# Altium schematic sheet mboard.SchDoc
size A3
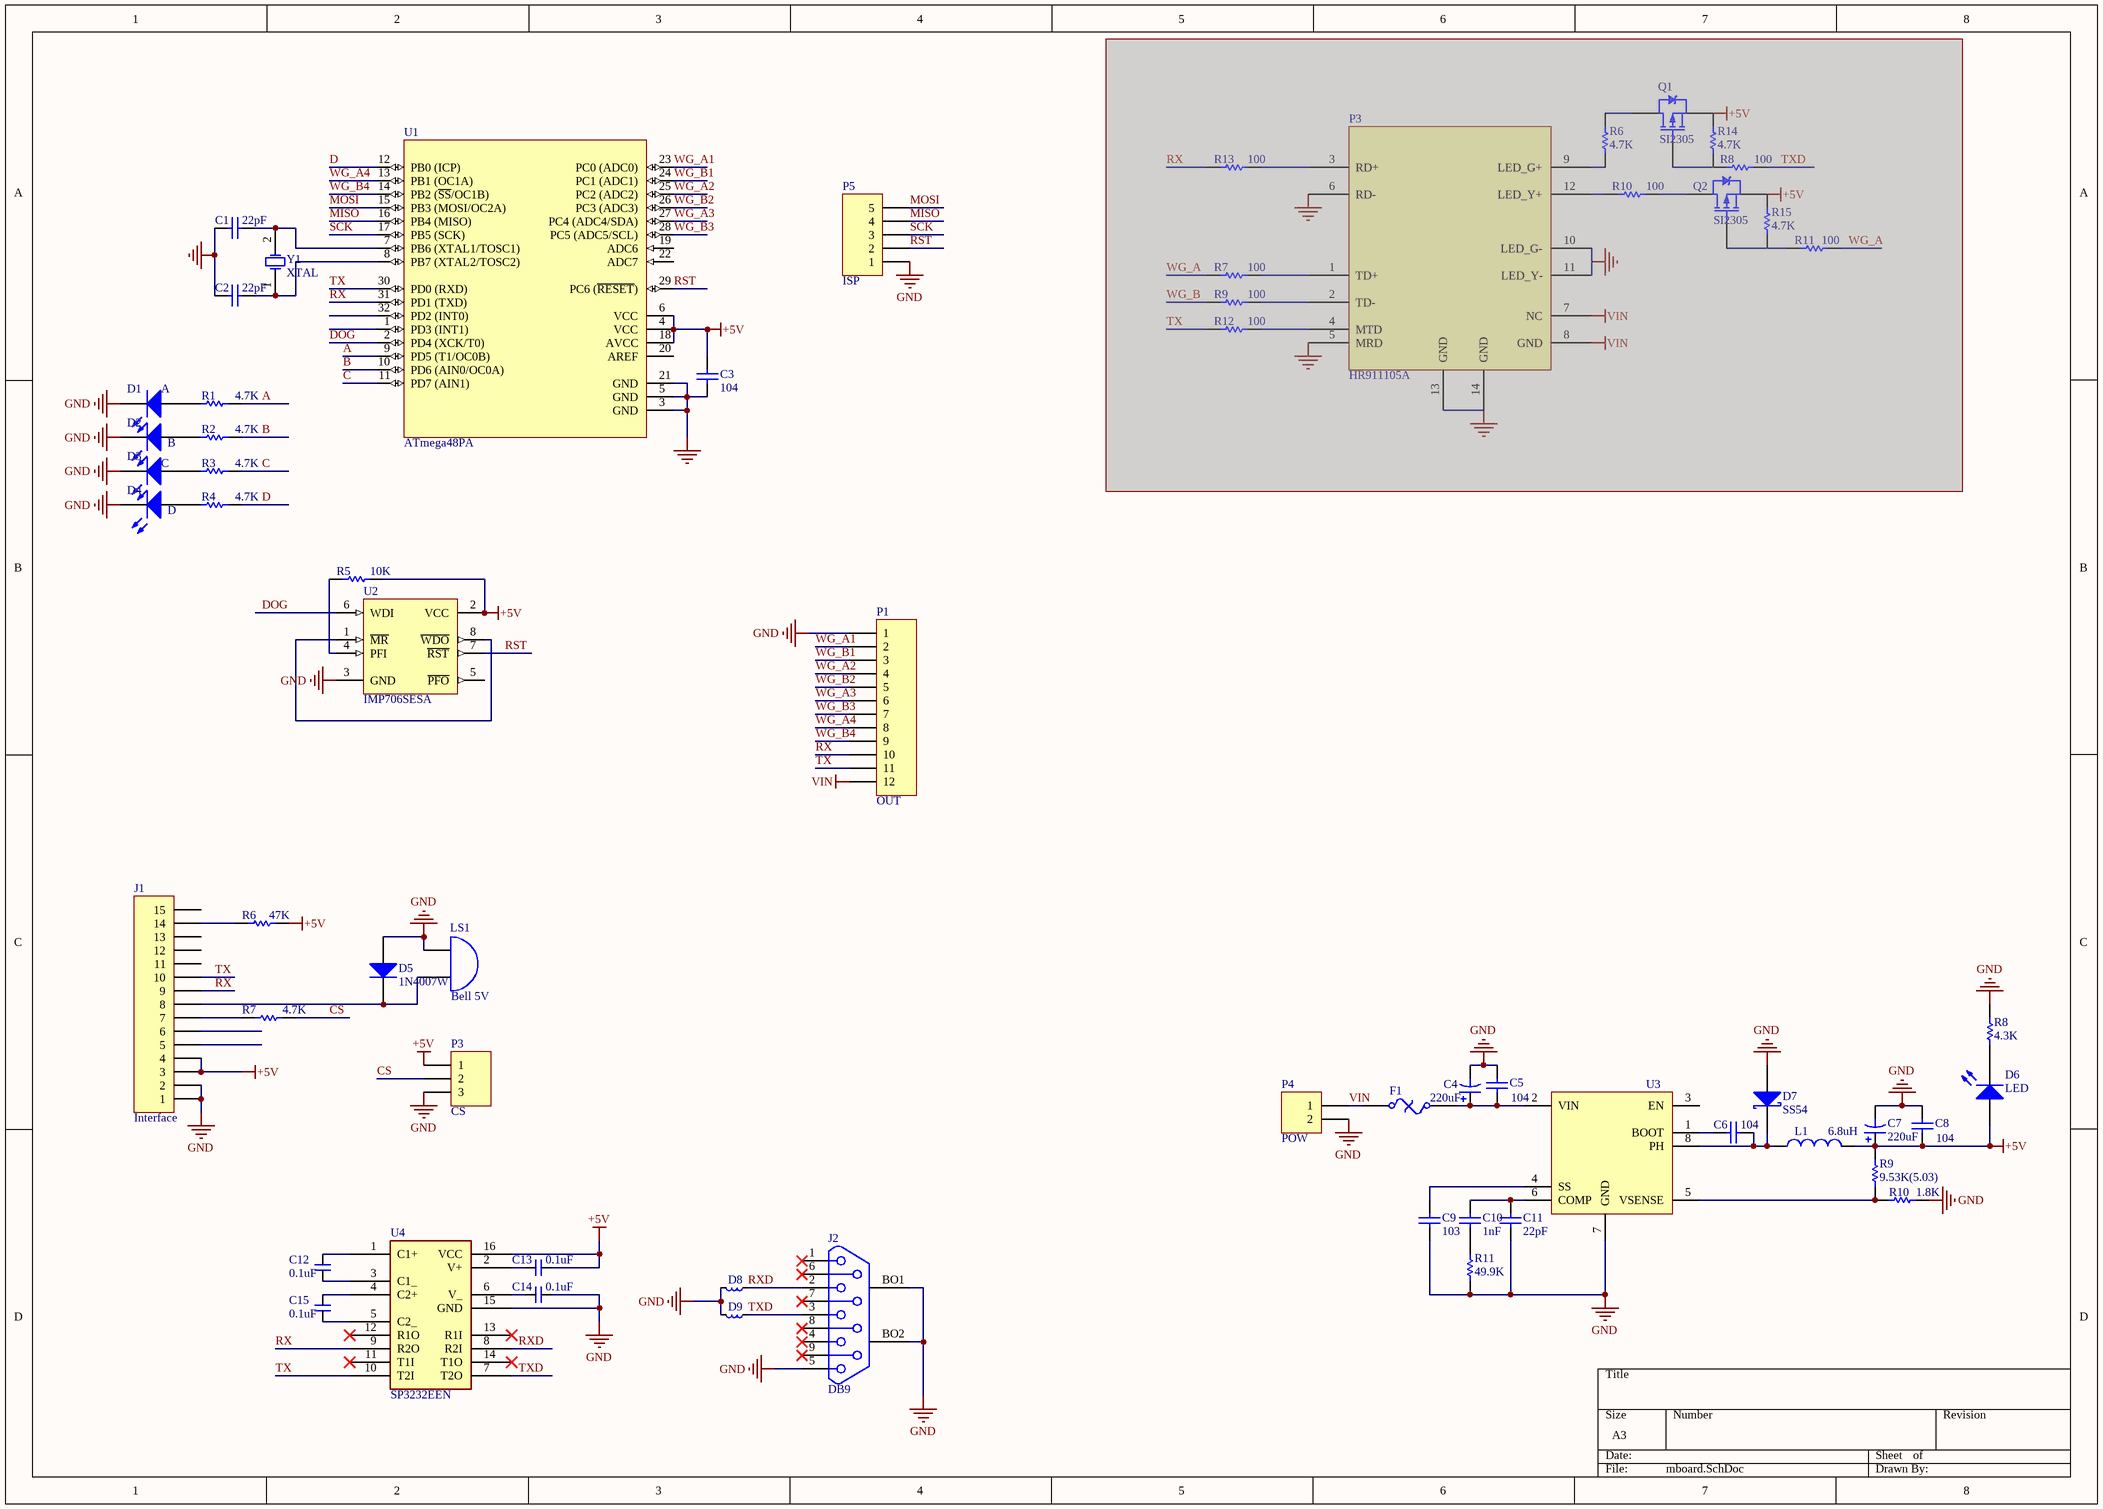
[diagram p0: mboard.SchDoc]

## Parts
(Parts that share a designator on the sheet are numbered #1, #2 ... from top to bottom, then left to right.)
C1  value 22pF  [0603C]  (hidden comment: Cap)
C2  value 22pF  [0603C]  (hidden comment: Cap)
C3  value 104  [0603C]  (hidden comment: Cap)
C4  value 220uF  [C8x10-SMD]  (hidden comment: Cap Pol1)
C5  value 104  [0603C]  (hidden comment: Cap)
C6  value 104  [0603C]  (hidden comment: Cap)
C7  value 220uF  [C6.3x5.4-SMD]  (hidden comment: Cap Pol1)
C8  value 104  [0603C]  (hidden comment: Cap)
C9  value 103  [0603C]  (hidden comment: Cap)
C10  value 1nF  [0603C]  (hidden comment: Cap)
C11  value 22pF  [0603C]  (hidden comment: Cap)
C12  0.1uF  [0603C]
C13  0.1uF  [0603C]
C14  0.1uF  [0603C]
C15  0.1uF  [0603C]
D1  A  [0603-LED]
D2  B  [0603-LED]
D3  C  [0603-LED]
D4  D  [0603-LED]
D5  1N4007W  [SOD-123]
D6  LED  [0603-LED]
D7  SS54  [SMA]
D8  ESD  [0603L]  (value not drawn)
D9  ESD  [0603L]  (value not drawn)
F1  Fuse Thermal  [1812F]  (value not drawn)
J1  Interface  [1.25-15P]
J2  DB9  [DB-9/M]
L1  value 6.8uH  [L-6045]  (hidden comment: Inductor)
LS1  value Bell 5V  [BEEP-9x5.5]  (hidden comment: Bell)
P1  OUT  [1.25-12P]
P3#1  HR911105A  [RJ-45]  (masked out: inside a compile mask, not in the netlist)
P3#2  CS  [HDR1X3]
P4  POW  [DC-005]
P5  ISP  [HDR1X5]
Q1  SI2305  [SOT-23-PMOS]  (masked out: inside a compile mask, not in the netlist)
Q2  SI2305  [SOT-23-PMOS]  (masked out: inside a compile mask, not in the netlist)
R1  value 4.7K  [0603R]  (hidden comment: Res1)
R2  value 4.7K  [0603R]  (hidden comment: Res1)
R3  value 4.7K  [0603R]  (hidden comment: Res1)
R4  value 4.7K  [0603R]  (hidden comment: Res1)
R5  value 10K  [0603R]  (hidden comment: Res1)
R6#1  value 4.7K  [0603]  (hidden comment: Res Semi)  (masked out: inside a compile mask, not in the netlist)
R6#2  value 47K  [0603R]  (hidden comment: Res Semi)
R7#1  value 100  [0603]  (hidden comment: Res Semi)  (masked out: inside a compile mask, not in the netlist)
R7#2  value 4.7K  [0603R]  (hidden comment: Res Semi)
R8#1  value 100  [0603]  (hidden comment: Res Semi)  (masked out: inside a compile mask, not in the netlist)
R8#2  value 4.3K  [0603R]  (hidden comment: Res1)
R9#1  value 100  [0603]  (hidden comment: Res Semi)  (masked out: inside a compile mask, not in the netlist)
R9#2  value 9.53K(5.03)  [0603R]  (hidden comment: Res Semi)
R10#1  value 100  [0603]  (hidden comment: Res Semi)  (masked out: inside a compile mask, not in the netlist)
R10#2  value 1.8K  [0603R]  (hidden comment: Res Semi)
R11#1  value 100  [0603]  (hidden comment: Res Semi)  (masked out: inside a compile mask, not in the netlist)
R11#2  value 49.9K  [0603R]  (hidden comment: Res Semi)
R12  value 100  [0603]  (hidden comment: Res Semi)  (masked out: inside a compile mask, not in the netlist)
R13  value 100  [0603]  (hidden comment: Res Semi)  (masked out: inside a compile mask, not in the netlist)
R14  value 4.7K  [0603]  (hidden comment: Res Semi)  (masked out: inside a compile mask, not in the netlist)
R15  value 4.7K  [0603]  (hidden comment: Res Semi)  (masked out: inside a compile mask, not in the netlist)
U1  ATmega48PA  [32A_N]
U2  IMP706SESA  [SOIC8]
U3  TPS54331  [SOP8-POW]  (value not drawn)
U4  SP3232EEN  [SOIC16-1.27]
Y1  XTAL  [49SD]

## Nets
+5V: C3.2 C7.1 C8.1 C13.2 D6.1(A) J1.3 J1.4 L1.2 P3#2.1 R5.2 R6#2.1 R9#2.2 U1.4(VCC) U1.6(VCC) U1.18(AVCC) U2.2(VCC) U4.16(VCC)
GND: C1.2 C2.2 C3.1 C4.2 C5.2 C7.2 C8.2 C9.2 C11.1 C14.2 D1.2(K) D2.2(K) D3.2(K) D4.2(K) D5.1(A) D7.1(A) D8.2 D9.2 J1.1 J1.2 J2.5 J2.BO1 J2.BO2 LS1.1(A) P1.1 P3#2.3 P4.2 P5.1 R8#2.1 R10#2.2 R11#2.1 U1.3(GND) U1.5(GND) U1.21(GND) U2.3(GND) U3.7(GND) U3.9(12) U4.15(GND)
VIN: F1.1 P1.12 P4.1
A: R1.1 U1.9(PD5_(T1/OC0B))
B: R2.1 U1.10(PD6_(AIN0/OC0A))
C: R3.1 U1.11(PD7_(AIN1))
CS: P3#2.2 R7#2.2
D: R4.1 U1.12(PB0_(ICP))
DOG: U1.2(PD4_(XCK/T0)) U2.6(WDI)
MISO: P5.4 U1.16(PB4_(MISO))
MOSI: P5.5 U1.15(PB3_(MOSI/OC2A))
RST: P5.2 U1.29(PC6_(~{RESET})) U2.7(~{RST})
RX: J1.9 P1.10 U1.31(PD1_(TXD)) U4.9(R2O)
RXD: D8.1 J2.2 U4.8(R2I)
SCK: P5.3 U1.17(PB5_(SCK))
TX: J1.10 P1.11 U1.30(PD0_(RXD)) U4.10(T2I)
TXD: D9.1 J2.3 U4.7(T2O)
WG_A1: P1.2 U1.23(PC0_(ADC0))
WG_A2: P1.4 U1.25(PC2_(ADC2))
WG_A3: P1.6 U1.27(PC4_(ADC4/SDA))
WG_A4: P1.8 U1.13(PB1_(OC1A))
WG_B1: P1.3 U1.24(PC1_(ADC1))
WG_B2: P1.5 U1.26(PC3_(ADC3))
WG_B3: P1.7 U1.28(PC5_(ADC5/SCL))
WG_B4: P1.9 U1.14(PB2_(~{SS}/OC1B))
NetC1_1: C1.1 U1.7(PB6_(XTAL1/TOSC1)) Y1.2(OSC2)
NetC2_1: C2.1 U1.8(PB7_(XTAL2/TOSC2)) Y1.1(OSC1)
NetC4_1: C4.1 C5.1 F1.2 U3.2(VIN)
NetC6_1: C6.1 D7.2(K) L1.1 U3.8(PH)
NetC6_2: C6.2 U3.1(BOOT)
NetC9_1: C9.1 U3.4(SS)
NetC10_1: C10.1 R11#2.2
NetC10_2: C10.2 C11.2 U3.6(COMP)
NetC12_1: C12.1 U4.1(C1+)
NetC12_2: C12.2 U4.3(C1_)
NetC13_1: C13.1 U4.2(V+)
NetC14_1: C14.1 U4.6(V_)
NetC15_1: C15.1 U4.4(C2+)
NetC15_2: C15.2 U4.5(C2_)
NetD1_1: D1.1(A) R1.2
NetD2_1: D2.1(A) R2.2
NetD3_1: D3.1(A) R3.2
NetD4_1: D4.1(A) R4.2
NetD5_2: D5.2(K) J1.8 LS1.2(B)
NetD6_2: D6.2(K) R8#2.2
NetJ1_7: J1.7 R7#2.1
NetJ1_14: J1.14 R6#2.2
NetR5_1: R5.1 U2.4(PFI)
NetR9#2_1: R9#2.1 R10#2.1 U3.5(VSENSE)
NetU2_1: U2.1(~{MR}) U2.8(~{WDO})

Not connected (* = marked no-connect by the designer): J1 5 6 11 12 13 15; J2 1* 4* 6* 7* 8* 9*; U1 1(PD3_(INT1)) 19(ADC6) 20(AREF) 22(ADC7) 32(PD2_(INT0)); U2 5(~{PFO}); U3 3(EN); U4 11(T1I)* 12(R1O)* 13(R1I)* 14(T1O)*

## Library data of the parts
C1-C3 C5 C6 C8-C11 = Cap: Capacitor; Published: 8-Jun-2000; LatestRevisionDate: 17-Jul-2002; LatestRevisionNote: Re-released for DXP Platform.; PackageReference: RAD-0.3; Publisher: Altium Limited
  C5 C6 C8-C11: PackageDescription: Radial Cap, Thru-Hole; 2 Leads; 0.3 in Pin Spacing
C4 C7 = Cap Pol1: Polarized Capacitor (Radial); Published: 8-Jun-2000; LatestRevisionDate: 17-Jul-2002; LatestRevisionNote: Re-released for DXP Platform.; PackageReference: RB7.6-15; Publisher: Altium Limited; PackageDescription: Polarized Capacitor (Radial); 2 Leads
C12-C15 = 电容
D1-D4 = LED2: Typical RED, GREEN, YELLOW, AMBER GaAs LED; Value: GRN; Published: 8-Jun-2000; LatestRevisionDate: 17-Jul-2002; LatestRevisionNote: Re-released for DXP Platform.; PackageDocument: Feb-2002; PackageReference: 3.2X1.6X1.1; Publisher: Altium Limited
D5 = Diode 1N5408: 3 Amp Medium Power Silicon Rectifier Diode; Value: SS54; Published: 8-Jun-2000; LatestRevisionDate: 17-Jul-2002; LatestRevisionNote: Re-released for DXP Platform.; DatasheetDocument: Aug-1984; PackageReference: DO-201AD; Publisher: Altium Limited; ComponentLink1Description: Manufacturer Link; ComponentLink1URL: http://www.irf.com/
D6 = LED1: Typical RED GaAs LED; Published: 8-Jun-2000; LatestRevisionDate: 08-Jul-2005; LatestRevisionNote: Mech Layer 1 removed.; PackageReference: LED-1; Publisher: Altium Limited
D7 = D Schottky: Schottky Diode; Published: 8-Jun-2000; LatestRevisionDate: 17-Jul-2002; LatestRevisionNote: Re-released for DXP Platform.; PackageReference: SMB; Publisher: Altium Limited; PackageDescription: DO-214-AA/SMB; 2 C-Bend Leads; Body 5.3 x 3.6 mm, inc. leads (LxW); Code_JEDEC: DO-214-AA
D8 D9 = 电感
F1 = Fuse Thermal: Thermal Fuse; Published: 24-Mar-1999; LatestRevisionDate: 17-Jul-2002; LatestRevisionNote: Re-released for DXP Platform.; PackageReference: PIN-W2/E2.8; Publisher: Altium Limited; PackageDescription: Thru-Hole; 2 Leads
J1 = Header 15: Header, 15-Pin; LatestRevisionDate: 17-Jul-2002; LatestRevisionNote: Re-released for DXP Platform.; Publisher: Altium Limited
L1 = Inductor: Code_IEC: 1005; Published: 8-Jun-2000; LatestRevisionDate: 29-May-2009; LatestRevisionNote: IPC-7351 Footprint Added.; PackageReference: 0402-A; Publisher: Altium Limited; PackageDescription: Chip Inductor; Code_JEITA: 0402
LS1 = Bell: Electrical Bell; pin to pad: 1>2 2>1; Published: 24-Mar-1999; LatestRevisionDate: 17-Jul-2002; LatestRevisionNote: Re-released for DXP Platform.; PackageReference: PIN2; Publisher: Altium Limited
P1 = Header 12: Header, 12-Pin; LatestRevisionDate: 17-Jul-2002; LatestRevisionNote: Re-released for DXP Platform.; Publisher: Altium Limited
P3#2 = Header 3: Header, 3-Pin; LatestRevisionDate: 17-Jul-2002; LatestRevisionNote: Re-released for DXP Platform.; Publisher: Altium Limited
P4 = Header 2: Header, 2-Pin; LatestRevisionDate: 17-Jul-2002; LatestRevisionNote: Re-released for DXP Platform.; Publisher: Altium Limited
P5 = Header 5: Header, 5-Pin; LatestRevisionDate: 17-Jul-2002; LatestRevisionNote: Re-released for DXP Platform.; Publisher: Altium Limited
Q1 Q2 = IRF9Z14S: HEXFET P-Channel Power MOSFET; Published: 8-Jun-2000; LatestRevisionDate: 17-Jul-2002; LatestRevisionNote: Re-released for DXP Platform.; DatasheetVersion: Aug-1997; PackageReference: D2PAK; Publisher: Altium Limited; PackageDescription: D2-PAK/TO-263-AB; 3 Leads (1 Cropped); Body 15.5 (inc. leads) x 10.5 mm (LxW max); ComponentLink1Description: Manufacturer Link; ComponentLink1URL: http://www.irf.com/; ComponentLink2Description: Datasheet; ComponentLink2URL: http://www.irf.com/product-info/datasheets/data/irf9z14s.pdf
R1-R5 R8#2 = Res1: Resistor; Published: 8-Jun-2000; LatestRevisionDate: 17-Jul-2002; LatestRevisionNote: Re-released for DXP Platform.; PackageReference: AXIAL-0.3; Publisher: Altium Limited
R6#1 R6#2 R7#1 R7#2 R8#1 R9#1 R9#2 R10#1 R10#2 R11#1 R11#2 R12-R15 = Res Semi: Semiconductor Resistor; Published: 8-Jun-2000; LatestRevisionDate: 17-Jul-2002; LatestRevisionNote: Re-released for DXP Platform.; PackageReference: AXIAL-0.5; Publisher: Altium Limited; PackageDescription: Axial Device, Thru-Hole; 2 Leads; 0.5 in Pin Spacing
U1 = ATmega8-16AC: 8-Bit AVR Microcontroller with 8K Bytes of In-System Programmable Flash Memory; Published: 17-Sep-2003; LatestRevisionDate: 13-Apr-2006; LatestRevisionNote: IPC-7351 Footprint Added.; DatasheetVersion: 2486H-AVR-09/02; PackageVersion: revB, Oct-2001; PackageReference: 32A; Publisher: Altium Limited; PackageDescription: 32-Pin Thin Quad Flat Pack 0.8 mm Pitch; Code_JEDEC: MS-026-ABA; ComponentLink1Description: Manufacturer Link; ComponentLink1URL: http://www.atmel.com; ComponentLink2Description: Datasheet; ComponentLink2URL: http://www.atmel.com/dyn/resources/prod_documents/doc2486.pdf
U2 = MAX706RCSA: +3V Voltage Monitoring, Low-Cost, 礟 Supervisory Circuit; Published: 16-Jan-2001; LatestRevisionDate: 13-Apr-2006; LatestRevisionNote: IPC-7351 Footprint Added.; DatasheetVersion: Sep-1995; PackageReference: NSO8; Publisher: Altium Limited; PackageDescription: 8-Pin Small Outline Integrated Circuit 1.27 mm Pitch; Code_JEDEC: MS-012-AA; Code_IPC: SOIC127P600-8; ComponentLink1Description: Manufacturer Link; ComponentLink1URL: http://www.maxim-ic.com/; ComponentLink2Description: Datasheet; ComponentLink2URL: http://pdfserv.maxim-ic.com/en/ds/MAX706P-MAX708T.pdf
U4 = MAX232ESE: Text Field1: MAXIM; Text Field2: RS232; MAXIM: *
Y1 = XTAL: Crystal Oscillator; Published: 8-Jun-2000; LatestRevisionDate: 17-Jul-2002; LatestRevisionNote: Re-released for DXP Platform.; PackageReference: R38; Publisher: Altium Limited